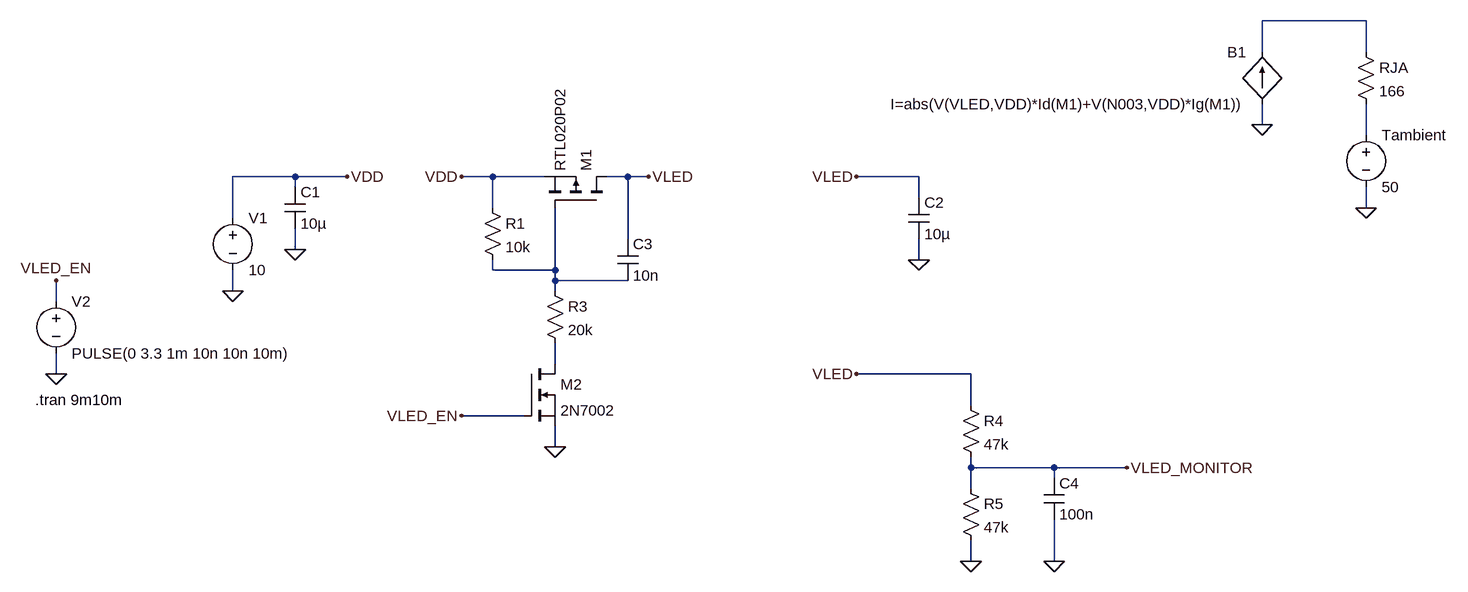
[diagram p0: schematic 5V_LED switch.asc]
5V_LED switch.asc, the LTspice schematic file:
Version 4
SHEET 1 1976 680
WIRE 1840 -224 1680 -224
WIRE 1680 -176 1680 -224
WIRE 1840 -176 1840 -224
WIRE 1680 -64 1680 -96
WIRE 1840 -48 1840 -96
WIRE 192 16 96 16
WIRE 272 16 192 16
WIRE 496 16 448 16
WIRE 576 16 496 16
WIRE 704 16 672 16
WIRE 736 16 704 16
WIRE 1152 16 1056 16
WIRE 192 32 192 16
WIRE 1152 48 1152 16
WIRE 496 64 496 16
WIRE 1840 64 1840 32
WIRE 96 80 96 16
WIRE 704 112 704 16
WIRE 192 128 192 96
WIRE 1152 144 1152 112
WIRE 496 160 496 144
WIRE 592 160 592 64
WIRE 592 160 496 160
WIRE 592 176 592 160
WIRE 704 176 592 176
WIRE 96 192 96 160
WIRE 592 192 592 176
WIRE -176 208 -176 176
WIRE 592 304 592 272
WIRE -176 320 -176 288
WIRE 1232 320 1056 320
WIRE 1232 368 1232 320
WIRE 544 384 448 384
WIRE 592 432 592 400
WIRE 1232 464 1232 448
WIRE 1360 464 1232 464
WIRE 1472 464 1360 464
WIRE 1360 480 1360 464
WIRE 1232 496 1232 464
WIRE 1232 608 1232 576
WIRE 1360 608 1360 544
FLAG 192 128 0
FLAG 96 192 0
FLAG -176 320 0
FLAG 272 16 VDD
FLAG 592 432 0
FLAG 1152 144 0
FLAG 1056 16 VLED
FLAG 448 16 VDD
FLAG 448 384 VLED_EN
FLAG -176 176 VLED_EN
FLAG 736 16 VLED
FLAG 1680 -64 0
FLAG 1840 64 0
FLAG 1232 608 0
FLAG 1360 608 0
FLAG 1472 464 VLED_MONITOR
FLAG 1056 320 VLED
SYMBOL voltage 96 64 R0
WINDOW 123 0 0 Left 0
WINDOW 39 0 0 Left 0
SYMATTR InstName V1
SYMATTR Value 10
SYMBOL voltage -176 192 R0
WINDOW 123 0 0 Left 0
WINDOW 39 0 0 Left 0
SYMATTR InstName V2
SYMATTR Value PULSE(0 3.3 1m 10n 10n 10m)
SYMBOL pmos 672 64 M270
SYMATTR InstName M1
SYMATTR Value RTL020P02
SYMBOL cap 176 32 R0
SYMATTR InstName C1
SYMATTR Value 10µ
SYMBOL nmos 544 304 R0
SYMATTR InstName M2
SYMATTR Value 2N7002
SYMBOL res 480 48 R0
SYMATTR InstName R1
SYMATTR Value 10k
SYMBOL cap 1136 48 R0
SYMATTR InstName C2
SYMATTR Value 10µ
SYMBOL res 576 176 R0
SYMATTR InstName R3
SYMATTR Value 20k
SYMBOL voltage 1840 -64 R0
WINDOW 123 0 0 Left 0
WINDOW 39 0 0 Left 0
SYMATTR InstName Tambient
SYMATTR Value 50
SYMBOL bi 1680 -96 R180
WINDOW 0 24 80 Left 2
WINDOW 3 24 0 Left 2
SYMATTR InstName B1
SYMATTR Value I=abs(V(VLED,VDD)*Id(M1)+V(N003,VDD)*Ig(M1))
SYMBOL res 1824 -192 R0
SYMATTR InstName RJA
SYMATTR Value 166
SYMBOL res 1216 352 R0
SYMATTR InstName R4
SYMATTR Value 47k
SYMBOL res 1216 480 R0
SYMATTR InstName R5
SYMATTR Value 47k
SYMBOL cap 1344 480 R0
SYMATTR InstName C4
SYMATTR Value 100n
SYMBOL cap 688 112 R0
SYMATTR InstName C3
SYMATTR Value 10n
TEXT -208 360 Left 2 !.tran 9m10m

The netlist it stands for:
* 5V_LED switch.asc
V1 VDD 0 10
V2 VLED_EN 0 PULSE(0 3.3 1m 10n 10n 10m)
M1 VLED N003 VDD VDD RTL020P02
C1 VDD 0 10µ
M2 N004 VLED_EN 0 0 2N7002
R1 VDD N003 10k
C2 VLED 0 10µ
R3 N003 N004 20k
V§Tambient N002 0 50
B1 0 N001 I=abs(V(VLED,VDD)*Id(M1)+V(N003,VDD)*Ig(M1))
RJA N001 N002 166
R4 VLED VLED_MONITOR 47k
R5 VLED_MONITOR 0 47k
C4 VLED_MONITOR 0 100n
C3 VLED N003 10n
.model NMOS NMOS
.model PMOS PMOS
.lib standard.mos
.tran 9m10m
.backanno
.end